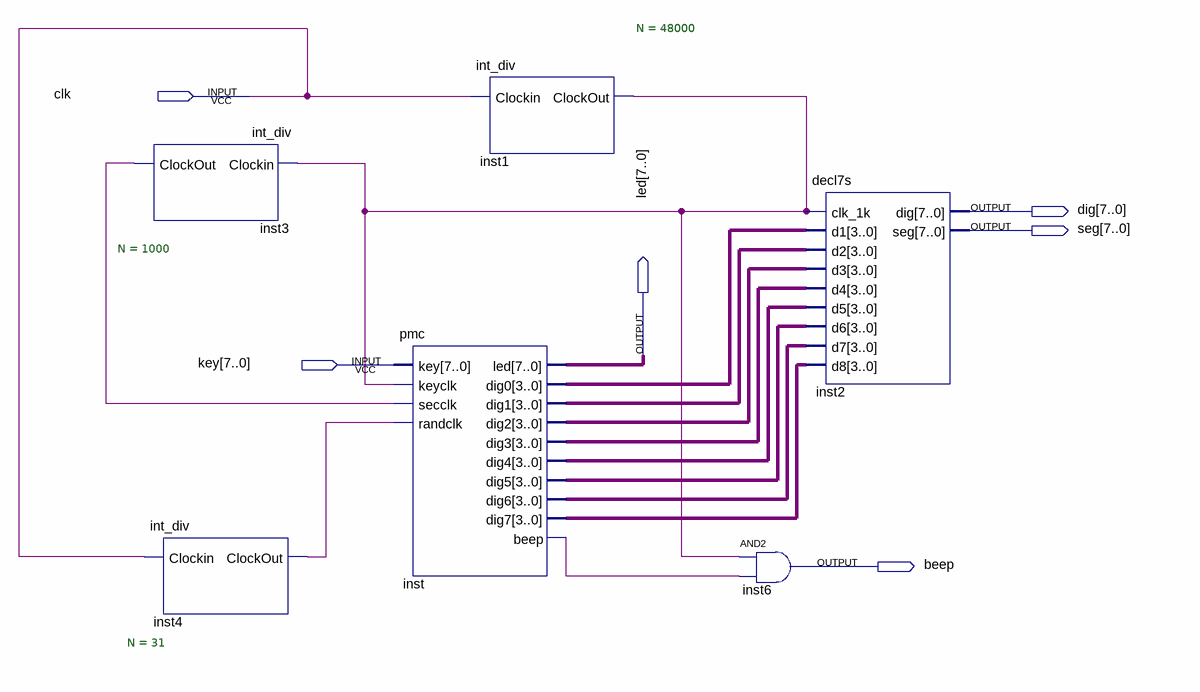
[diagram p0: schematic sheet]
// Quartus schematic pm.bdf as structural Verilog: 6 symbols, 6 pins
module pm (
  input  clk,
  input  [7:0] key,
  output [7:0] dig,
  output [7:0] seg,
  output [7:0] led,
  output beep
);

  wire inst1_clockout, inst3_clockout, inst4_clockout, inst_beep;
  wire [3:0] inst_dig0, inst_dig1, inst_dig2, inst_dig3, inst_dig4, inst_dig5, inst_dig6, inst_dig7;

  int_div #(.N(1000)) inst3 (.Clockin(inst1_clockout), .ClockOut(inst3_clockout));
  int_div #(.N(31)) inst4 (.Clockin(clk), .ClockOut(inst4_clockout));
  pmc inst (
    .key(key), .keyclk(inst1_clockout), .secclk(inst3_clockout), .randclk(inst4_clockout), .led(led),
    .dig0(inst_dig0), .dig1(inst_dig1), .dig2(inst_dig2), .dig3(inst_dig3), .dig4(inst_dig4),
    .dig5(inst_dig5), .dig6(inst_dig6), .dig7(inst_dig7), .beep(inst_beep));
  int_div #(.N(48000)) inst1 (.Clockin(clk), .ClockOut(inst1_clockout));
  and inst6 (beep, inst1_clockout, inst_beep);
  decl7s inst2 (
    .clk_1k(inst1_clockout), .d1(inst_dig0), .d2(inst_dig1), .d3(inst_dig2), .d4(inst_dig3), .d5(inst_dig4),
    .d6(inst_dig5), .d7(inst_dig6), .d8(inst_dig7), .dig(dig), .seg(seg));
endmodule
